# Altium schematic sheet Output.SchDoc
size A3; Date: 27.05.2014; DrawnBy: luths8; Organization: BFH; Address1: Bern University of Applied Sciences; Address2: Engineering and Information Technology; Address3: Jlcoweg 1; Address4: CH-3400 Burgdorf; DocumentNumber: 5; Revision: 1.1; SheetNumber: 5; SheetTotal: 5; CurrentDate: 27.05.2014
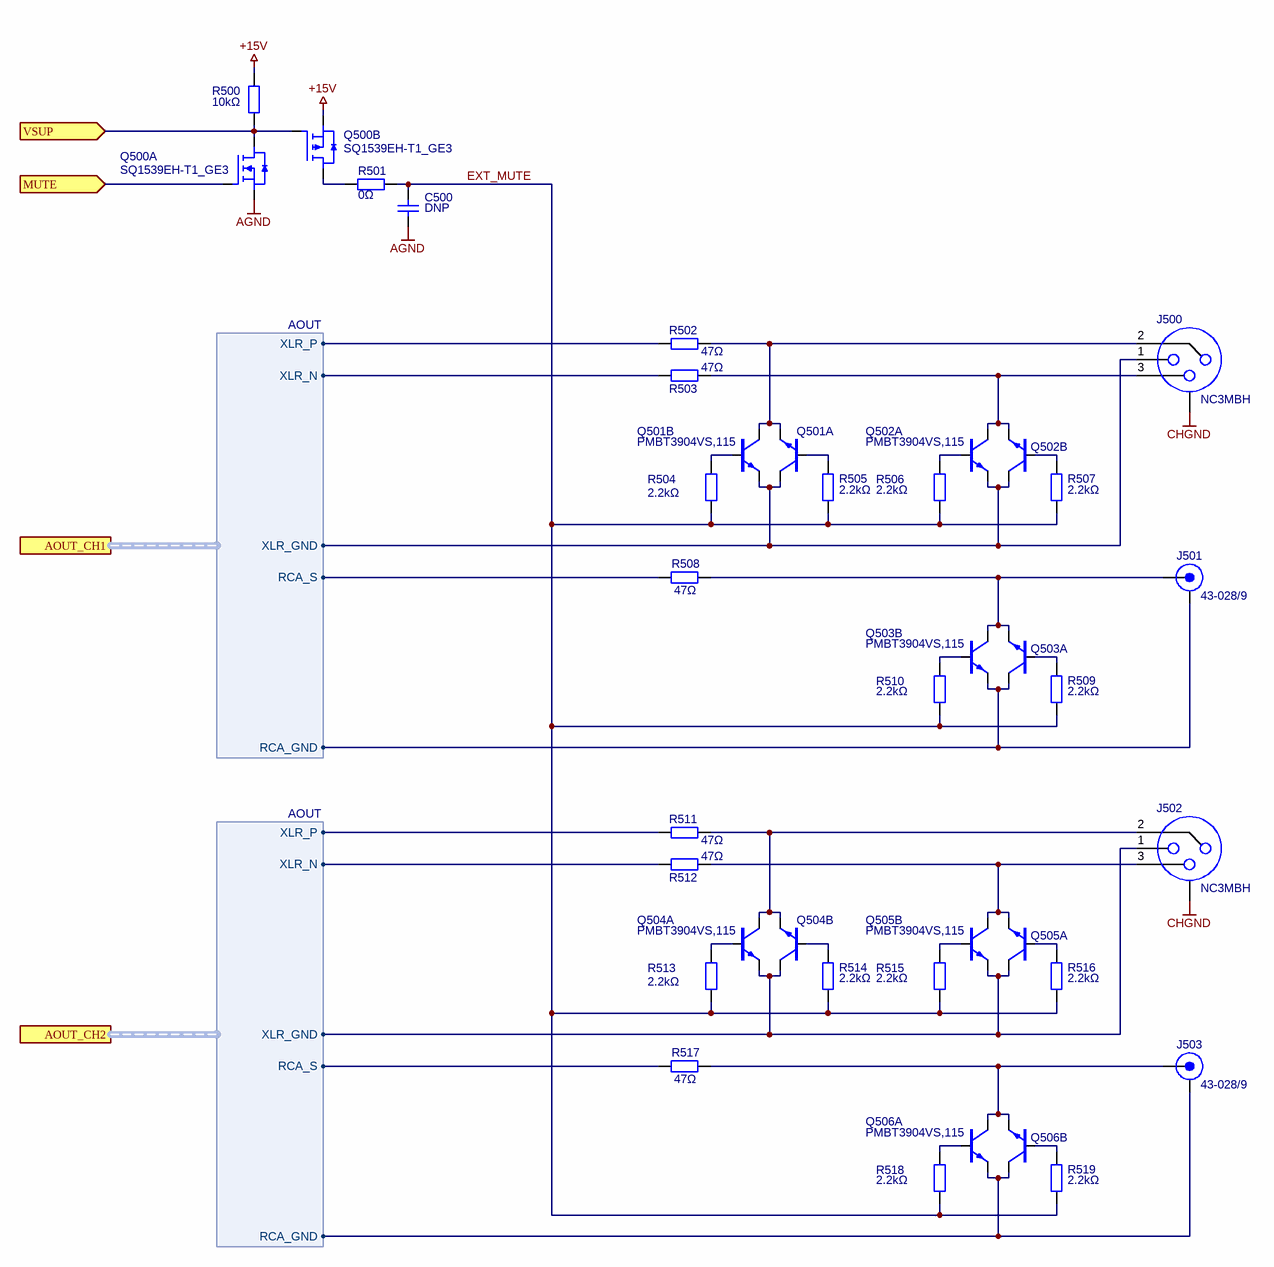
[diagram p0: Output.SchDoc]

## Parts
C500  DNP  [SMD0603CAP]
J500  NC3MBH  [NC3MBH]
J501  43-028/9  [RCA-Plug]
J502  NC3MBH  [NC3MBH]
J503  43-028/9  [RCA-Plug]
Q500  SQ1539EH-T1_GE3  [SOT-363-6]  (parts A,B of 2)
Q501  PMBT3904VS,115  [SOT-666]  (value not drawn)  (parts A,B of 2)
Q502  PMBT3904VS,115  [SOT-666]  (parts A,B of 2)
Q503  PMBT3904VS,115  [SOT-666]  (value not drawn)  (parts A,B of 2)
Q504  PMBT3904VS,115  [SOT-666]  (parts A,B of 2)
Q505  PMBT3904VS,115  [SOT-666]  (value not drawn)  (parts A,B of 2)
Q506  PMBT3904VS,115  [SOT-666]  (parts A,B of 2)
R500  10kΩ  [SMD0603RES]
R501  0Ω  [SMD0603RES]
R502  47Ω  [SMD0603RES]
R503  47Ω  [SMD0603RES]
R504  2.2kΩ  [SMD0603RES]
R505  2.2kΩ  [SMD0603RES]
R506  2.2kΩ  [SMD0603RES]
R507  2.2kΩ  [SMD0603RES]
R508  47Ω  [SMD0603RES]
R509  2.2kΩ  [SMD0603RES]
R510  2.2kΩ  [SMD0603RES]
R511  47Ω  [SMD0603RES]
R512  47Ω  [SMD0603RES]
R513  2.2kΩ  [SMD0603RES]
R514  2.2kΩ  [SMD0603RES]
R515  2.2kΩ  [SMD0603RES]
R516  2.2kΩ  [SMD0603RES]
R517  47Ω  [SMD0603RES]
R518  2.2kΩ  [SMD0603RES]
R519  2.2kΩ  [SMD0603RES]

## Ports
AOUT_CH1 (harness AOUT), AOUT_CH2 (harness AOUT), MUTE (in), VSUP (in)

## Harnesses
AOUT: XLR_P, XLR_N, XLR_GND, RCA_S, RCA_GND

## Nets
+15V: Q500.4(S) R500.2
AGND: C500.2(q) Q500.1(S)
CHGND: J500.0 J502.0
EXT_MUTE: C500.1 R501.1 R504.1 R505.1 R506.1 R507.1 R509.1 R510.1 R513.1 R514.1 R515.1 R516.1 R518.1 R519.1
MUTE: Q500.2(G) ; port MUTE
VSUP: Q500.5(G) Q500.6(D) R500.1 ; port VSUP
NetJ500_1: J500.1 Q501.4 Q501.6 Q502.1 Q502.3 ; port AOUT_CH1.XLR_GND
NetJ500_2: J500.2 Q501.1 Q501.3 R502.1
NetJ500_3: J500.3 Q502.4 Q502.6 R503.1
NetJ501_1: J501.1 Q503.1 Q503.3 R508.1
NetJ501_2: J501.2 Q503.4 Q503.6 ; port AOUT_CH1.RCA_GND
NetJ502_1: J502.1 Q504.1 Q504.3 Q505.4 Q505.6 ; port AOUT_CH2.XLR_GND
NetJ502_2: J502.2 Q504.4 Q504.6 R511.1
NetJ502_3: J502.3 Q505.1 Q505.3 R512.1
NetJ503_1: J503.1 Q506.4 Q506.6 R517.1
NetJ503_2: J503.2 Q506.1 Q506.3 ; port AOUT_CH2.RCA_GND
NetQ500_3: Q500.3(D) R501.2
NetQ501_2: Q501.2 R505.2
NetQ501_5: Q501.5 R504.2
NetQ502_2: Q502.2 R506.2
NetQ502_5: Q502.5 R507.2
NetQ503_2: Q503.2 R509.2
NetQ503_5: Q503.5 R510.2
NetQ504_2: Q504.2 R513.2
NetQ504_5: Q504.5 R514.2
NetQ505_2: Q505.2 R516.2
NetQ505_5: Q505.5 R515.2
NetQ506_2: Q506.2 R518.2
NetQ506_5: Q506.5 R519.2
NetR502_2: R502.2 ; port AOUT_CH1.XLR_P
NetR503_2: R503.2 ; port AOUT_CH1.XLR_N
NetR508_2: R508.2 ; port AOUT_CH1.RCA_S
NetR511_2: R511.2 ; port AOUT_CH2.XLR_P
NetR512_2: R512.2 ; port AOUT_CH2.XLR_N
NetR517_2: R517.2 ; port AOUT_CH2.RCA_S

## Notes on the sheet
- Project:
- Size:
- Sheet:
- Title:
- A3
- of
- Drawn by:
- Revision:
- Date:
- Variant:
- b
- File:

## Library data of the parts
C500 = Capacitor Ceramic: Ceramic Capacitor; Voltage: *; Manufacturer Part No.: *
J500 J502 = Connector XLR: XLR Connector Male, Panel Mount; Manufacturer Part No.: NC3MBH; System: Connector
J501 J503 = Connector RCA: RCA Connector; Manufacturer Part No.: *; System: Connector
Q500 = Transistor N/PMOS Dual: Transistor Dual, NMOS & PMOS; Manufacturer Part No.: SQ1539EH-T1_GE3
Q501-Q506 = Transistor Bipolar Dual: Manufacturer Part No.: PMBT3904VS,115
R500 R501 R504-R507 R509 R510 R513-R516 R518 R519 = Resistor: Manufacturer Part No.: *
R502 R503 R508 R511 R512 R517 = Resistor: Resistor Thin Film; Manufacturer Part No.: TNPW060347R0BEEA